# Altium schematic sheet BLOCK5.SchDoc
size A3; SheetNumber: 5; SheetTotal: 12
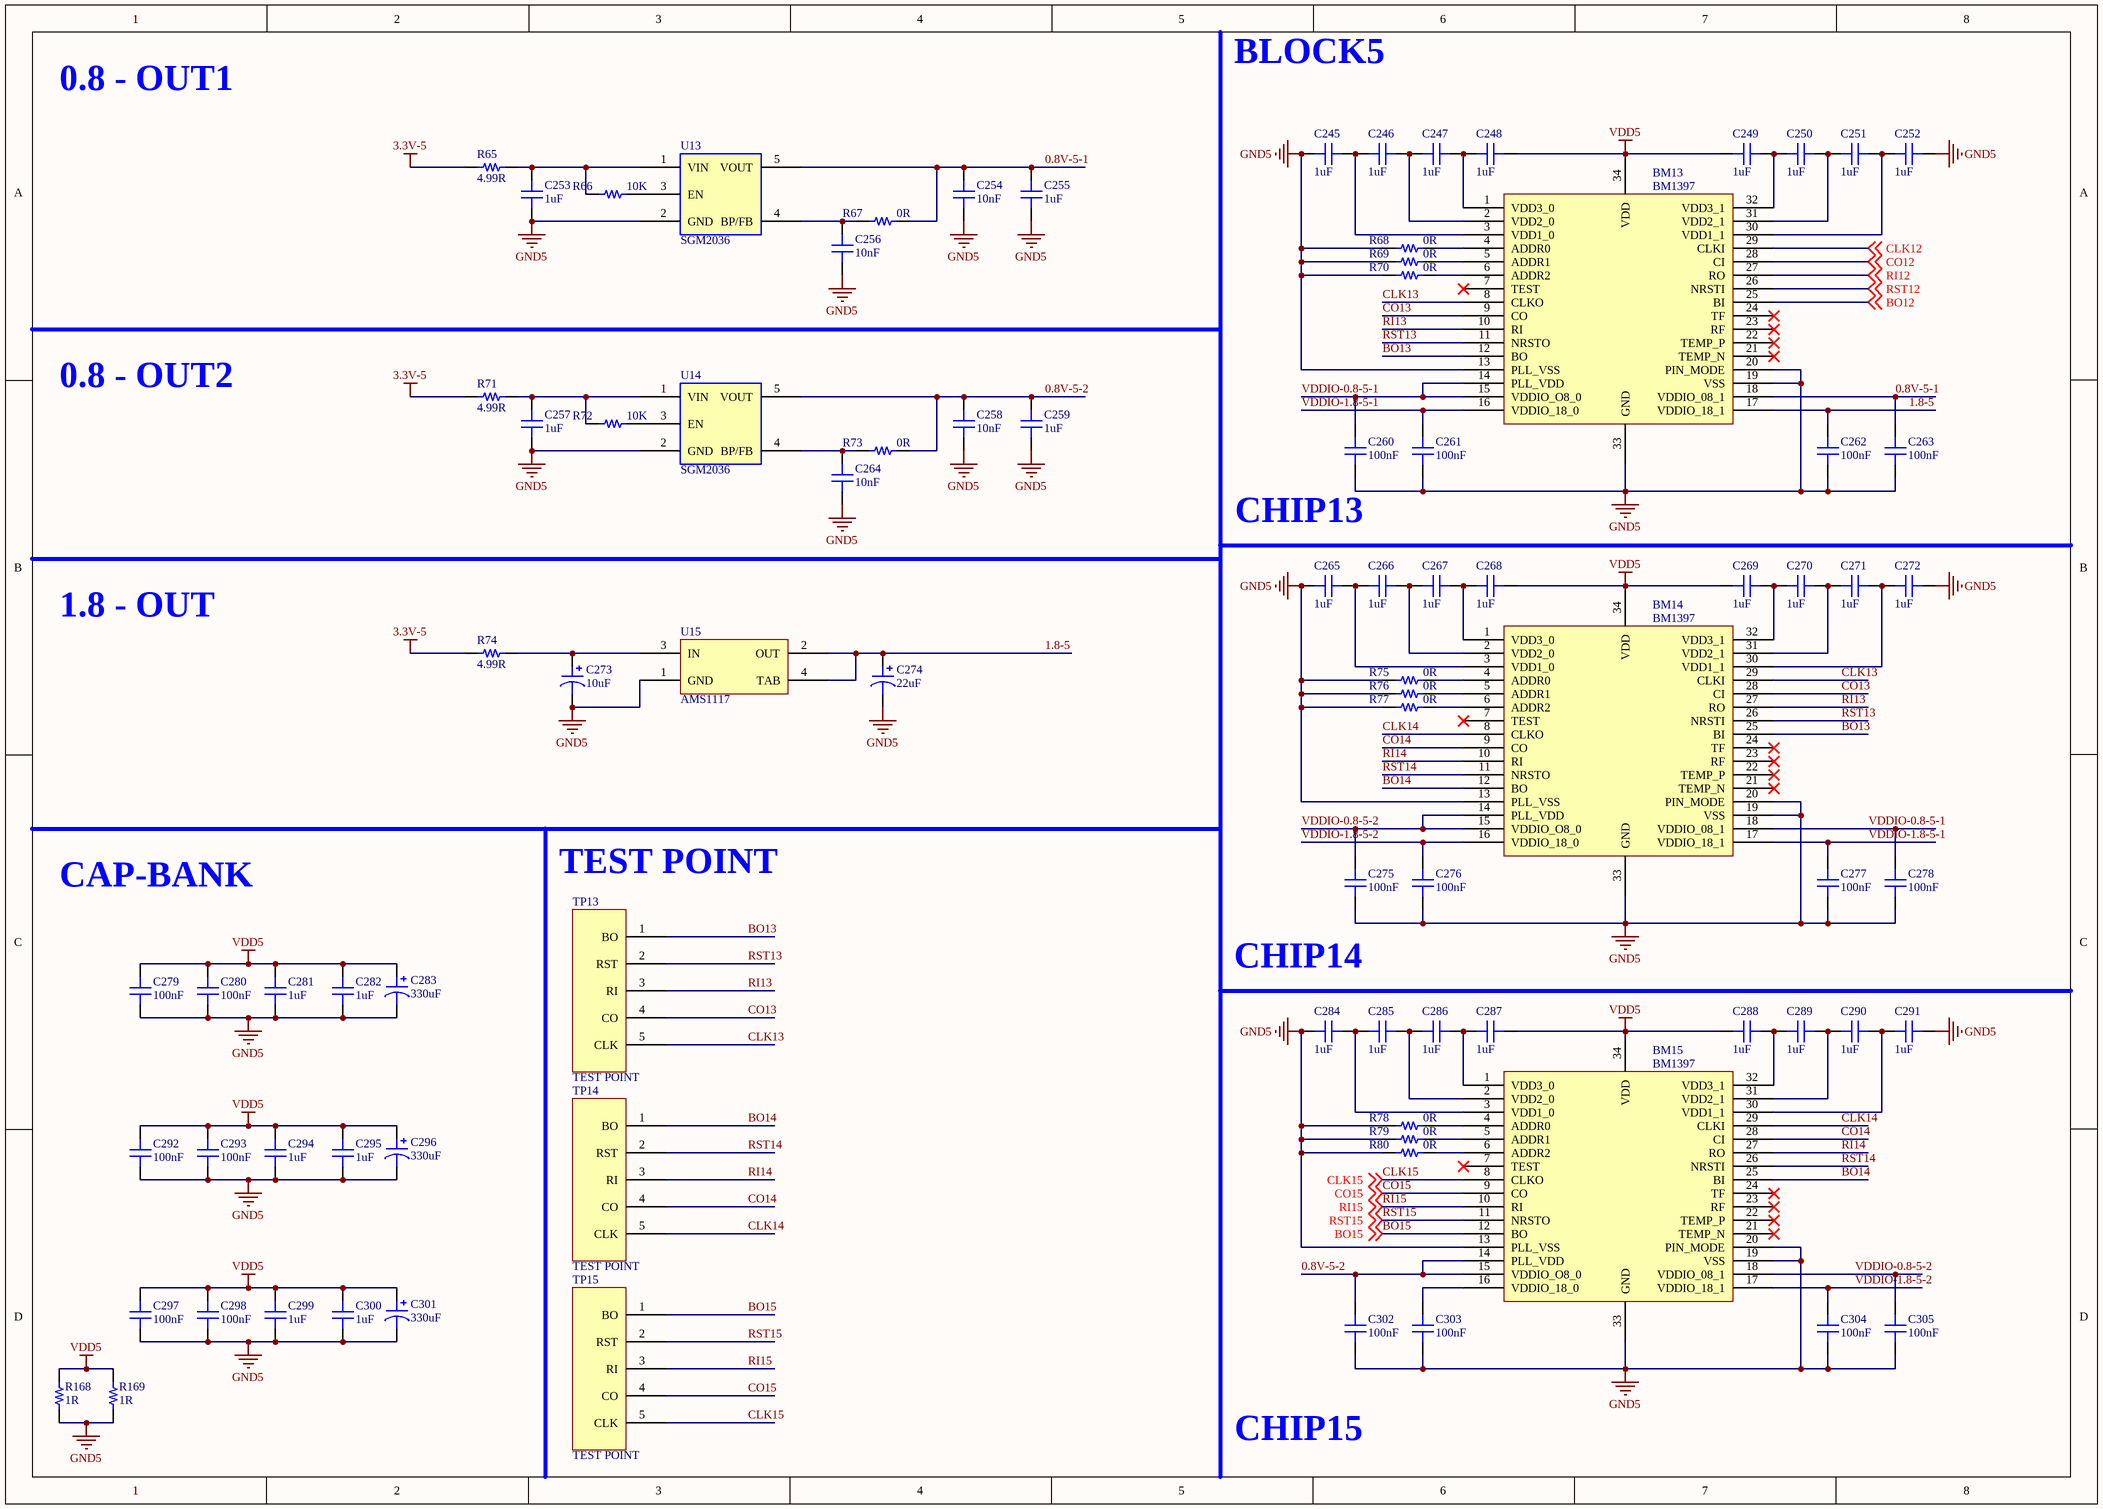
[diagram p0: BLOCK5.SchDoc]

## Parts
BM13  BM1397  [BM1387]
BM14  BM1397  [BM1387]
BM15  BM1397  [BM1387]
C245  1uF  [CAP-SMD-0603]
C246  1uF  [CAP-SMD-0603]
C247  1uF  [CAP-SMD-0603]
C248  1uF  [CAP-SMD-0603]
C249  1uF  [CAP-SMD-0603]
C250  1uF  [CAP-SMD-0603]
C251  1uF  [CAP-SMD-0603]
C252  1uF  [CAP-SMD-0603]
C253  1uF  [CAP_SMD_0805]
C254  10nF  [CAP_SMD_0805]
C255  1uF  [CAP_SMD_0805]
C256  10nF  [CAP_SMD_0805]
C257  1uF  [CAP_SMD_0805]
C258  10nF  [CAP_SMD_0805]
C259  1uF  [CAP_SMD_0805]
C260  100nF  [CAP_SMD_0805]
C261  100nF  [CAP_SMD_0805]
C262  100nF  [CAP_SMD_0805]
C263  100nF  [CAP_SMD_0805]
C264  10nF  [CAP_SMD_0805]
C265  1uF  [CAP-SMD-0603]
C266  1uF  [CAP-SMD-0603]
C267  1uF  [CAP-SMD-0603]
C268  1uF  [CAP-SMD-0603]
C269  1uF  [CAP-SMD-0603]
C270  1uF  [CAP-SMD-0603]
C271  1uF  [CAP-SMD-0603]
C272  1uF  [CAP-SMD-0603]
C273  10uF  [CAP-TAN-CASE-A]
C274  22uF  [CAP-TAN-CASE-A]
C275  100nF  [CAP_SMD_0805]
C276  100nF  [CAP_SMD_0805]
C277  100nF  [CAP_SMD_0805]
C278  100nF  [CAP_SMD_0805]
C279  100nF  [CAP_SMD_0805]
C280  100nF  [CAP_SMD_0805]
C281  1uF  [CAP_SMD_0805]
C282  1uF  [CAP_SMD_0805]
C283  330uF  [CAP-TAN-CASE-E]
C284  1uF  [CAP-SMD-0603]
C285  1uF  [CAP-SMD-0603]
C286  1uF  [CAP-SMD-0603]
C287  1uF  [CAP-SMD-0603]
C288  1uF  [CAP-SMD-0603]
C289  1uF  [CAP-SMD-0603]
C290  1uF  [CAP-SMD-0603]
C291  1uF  [CAP-SMD-0603]
C292  100nF  [CAP_SMD_0805]
C293  100nF  [CAP_SMD_0805]
C294  1uF  [CAP_SMD_0805]
C295  1uF  [CAP_SMD_0805]
C296  330uF  [CAP-TAN-CASE-E]
C297  100nF  [CAP_SMD_0805]
C298  100nF  [CAP_SMD_0805]
C299  1uF  [CAP_SMD_0805]
C300  1uF  [CAP_SMD_0805]
C301  330uF  [CAP-TAN-CASE-E]
C302  100nF  [CAP_SMD_0805]
C303  100nF  [CAP_SMD_0805]
C304  100nF  [CAP_SMD_0805]
C305  100nF  [CAP_SMD_0805]
R65  4.99R  [RES-SMD-1206]
R66  10K  [RES-SMD-0402]
R67  0R  [RES-SMD-0402]
R68  0R  [RES-SMD-0402]
R69  0R  [RES-SMD-0402]
R70  0R  [RES-SMD-0402]
R71  4.99R  [RES-SMD-1206]
R72  10K  [RES-SMD-0402]
R73  0R  [RES-SMD-0402]
R74  4.99R  [RES-SMD-1206]
R75  0R  [RES-SMD-0402]
R76  0R  [RES-SMD-0402]
R77  0R  [RES-SMD-0402]
R78  0R  [RES-SMD-0402]
R79  0R  [RES-SMD-0402]
R80  0R  [RES-SMD-0402]
R168  1R  [RES-SMD-1210]
R169  1R  [RES-SMD-1210]
TP13  TEST POINT  [TEST_POINT]
TP14  TEST POINT  [TEST_POINT]
TP15  TEST POINT  [TEST_POINT]
U13  SGM2036  [SOT23-5PIN]
U14  SGM2036  [SOT23-5PIN]
U15  AMS1117  [AMS1117]

## Nets
3.3V-5: R65.1 R71.1 R74.1
GND5: BM13.13(PLL_VSS) BM13.19(VSS) BM13.20(PIN_MODE) BM13.33(GND) BM14.13(PLL_VSS) BM14.19(VSS) BM14.20(PIN_MODE) BM14.33(GND) BM15.13(PLL_VSS) BM15.19(VSS) BM15.20(PIN_MODE) BM15.33(GND) C245.1 C252.2 C253.1 C254.1 C255.1 C256.1 C257.1 C258.1 C259.1 C260.1 C261.1 C262.1 C263.1 C264.1 C265.1 C272.2 C273.2 C274.2 C275.1 C276.1 C277.1 C278.1 C279.1 C280.1 C281.1 C282.1 C283.2 C284.1 C291.2 C292.1 C293.1 C294.1 C295.1 C296.2 C297.1 C298.1 C299.1 C300.1 C301.2 C302.1 C303.1 C304.1 C305.1 R68.1 R69.1 R70.1 R75.1 R76.1 R77.1 R78.1 R79.1 R80.1 R168.1 R169.1 U13.2(GND) U14.2(GND) U15.1(GND)
VDD5: BM13.34(VDD) BM14.34(VDD) BM15.34(VDD) C248.2 C249.1 C268.2 C269.1 C279.2 C280.2 C281.2 C282.2 C283.1 C287.2 C288.1 C292.2 C293.2 C294.2 C295.2 C296.1 C297.2 C298.2 C299.2 C300.2 C301.1 R168.2 R169.2
0.8V-5-1: BM13.18(VDDIO_08_1) C254.2 C255.2 C263.2 R67.2 U13.5(VOUT)
0.8V-5-2: BM15.14(PLL_VDD) BM15.15(VDDIO_O8_0) C258.2 C259.2 C302.2 R73.2 U14.5(VOUT)
1.8-5: BM13.17(VDDIO_18_1) C262.2 C274.1 U15.2(OUT) U15.4(TAB)
BO12: BM13.25(BI) ; off-sheet BO12
BO13: BM13.12(BO) BM14.25(BI) TP13.1(BO)
BO14: BM14.12(BO) BM15.25(BI) TP14.1(BO)
BO15: BM15.12(BO) TP15.1(BO) ; off-sheet BO15
CLK12: BM13.29(CLKI) ; off-sheet CLK12
CLK13: BM13.8(CLKO) BM14.29(CLKI) TP13.5(CLK)
CLK14: BM14.8(CLKO) BM15.29(CLKI) TP14.5(CLK)
CLK15: BM15.8(CLKO) TP15.5(CLK) ; off-sheet CLK15
CO12: BM13.28(CI) ; off-sheet CO12
CO13: BM13.9(CO) BM14.28(CI) TP13.4(CO)
CO14: BM14.9(CO) BM15.28(CI) TP14.4(CO)
CO15: BM15.9(CO) TP15.4(CO) ; off-sheet CO15
RI12: BM13.27(RO) ; off-sheet RI12
RI13: BM13.10(RI) BM14.27(RO) TP13.3(RI)
RI14: BM14.10(RI) BM15.27(RO) TP14.3(RI)
RI15: BM15.10(RI) TP15.3(RI) ; off-sheet RI15
RST12: BM13.26(NRSTI) ; off-sheet RST12
RST13: BM13.11(NRSTO) BM14.26(NRSTI) TP13.2(RST)
RST14: BM14.11(NRSTO) BM15.26(NRSTI) TP14.2(RST)
RST15: BM15.11(NRSTO) TP15.2(RST) ; off-sheet RST15
VDDIO-0.8-5-1: BM13.14(PLL_VDD) BM13.15(VDDIO_O8_0) BM14.18(VDDIO_08_1) C260.2 C278.2
VDDIO-0.8-5-2: BM14.14(PLL_VDD) BM14.15(VDDIO_O8_0) BM15.18(VDDIO_08_1) C275.2 C305.2
VDDIO-1.8-5-1: BM13.16(VDDIO_18_0) BM14.17(VDDIO_18_1) C261.2 C277.2
VDDIO-1.8-5-2: BM14.16(VDDIO_18_0) BM15.17(VDDIO_18_1) C276.2 C304.2
NetBM13_1: BM13.1(VDD3_0) C247.2 C248.1
NetBM13_2: BM13.2(VDD2_0) C246.2 C247.1
NetBM13_3: BM13.3(VDD1_0) C245.2 C246.1
NetBM13_4: BM13.4(ADDR0) R68.2
NetBM13_5: BM13.5(ADDR1) R69.2
NetBM13_6: BM13.6(ADDR2) R70.2
NetBM13_30: BM13.30(VDD1_1) C251.2 C252.1
NetBM13_31: BM13.31(VDD2_1) C250.2 C251.1
NetBM13_32: BM13.32(VDD3_1) C249.2 C250.1
NetBM14_1: BM14.1(VDD3_0) C267.2 C268.1
NetBM14_2: BM14.2(VDD2_0) C266.2 C267.1
NetBM14_3: BM14.3(VDD1_0) C265.2 C266.1
NetBM14_4: BM14.4(ADDR0) R75.2
NetBM14_5: BM14.5(ADDR1) R76.2
NetBM14_6: BM14.6(ADDR2) R77.2
NetBM14_30: BM14.30(VDD1_1) C271.2 C272.1
NetBM14_31: BM14.31(VDD2_1) C270.2 C271.1
NetBM14_32: BM14.32(VDD3_1) C269.2 C270.1
NetBM15_1: BM15.1(VDD3_0) C286.2 C287.1
NetBM15_2: BM15.2(VDD2_0) C285.2 C286.1
NetBM15_3: BM15.3(VDD1_0) C284.2 C285.1
NetBM15_4: BM15.4(ADDR0) R78.2
NetBM15_5: BM15.5(ADDR1) R79.2
NetBM15_6: BM15.6(ADDR2) R80.2
NetBM15_16: BM15.16(VDDIO_18_0) C303.2
NetBM15_30: BM15.30(VDD1_1) C290.2 C291.1
NetBM15_31: BM15.31(VDD2_1) C289.2 C290.1
NetBM15_32: BM15.32(VDD3_1) C288.2 C289.1
NetC253_2: C253.2 R65.2 R66.1 U13.1(VIN)
NetC256_2: C256.2 R67.1 U13.4(BP/FB)
NetC257_2: C257.2 R71.2 R72.1 U14.1(VIN)
NetC264_2: C264.2 R73.1 U14.4(BP/FB)
NetC273_1: C273.1 R74.2 U15.3(IN)
NetR66_2: R66.2 U13.3(EN)
NetR72_2: R72.2 U14.3(EN)

Not connected (* = marked no-connect by the designer): BM13 7(TEST)* 21(TEMP_N)* 22(TEMP_P)* 23(RF)* 24(TF)*; BM14 7(TEST)* 21(TEMP_N)* 22(TEMP_P)* 23(RF)* 24(TF)*; BM15 7(TEST)* 21(TEMP_N)* 22(TEMP_P)* 23(RF)* 24(TF)*

## Notes on the sheet
- 0.8 - OUT1
- BLOCK5
- 0.8 - OUT2
- (near C260) CHIP13
- 1.8 - OUT
- CAP-BANK
- TEST POINT
- CHIP14
- CHIP15

## Library data of the parts
BM13-BM15 = BM1397_0
C245-C272 C275-C282 C284-C295 C297-C300 C302-C305 = CAP
C273 C274 C283 C296 C301 = POLARIZED CAP
R65-R80 R168 R169 = RES